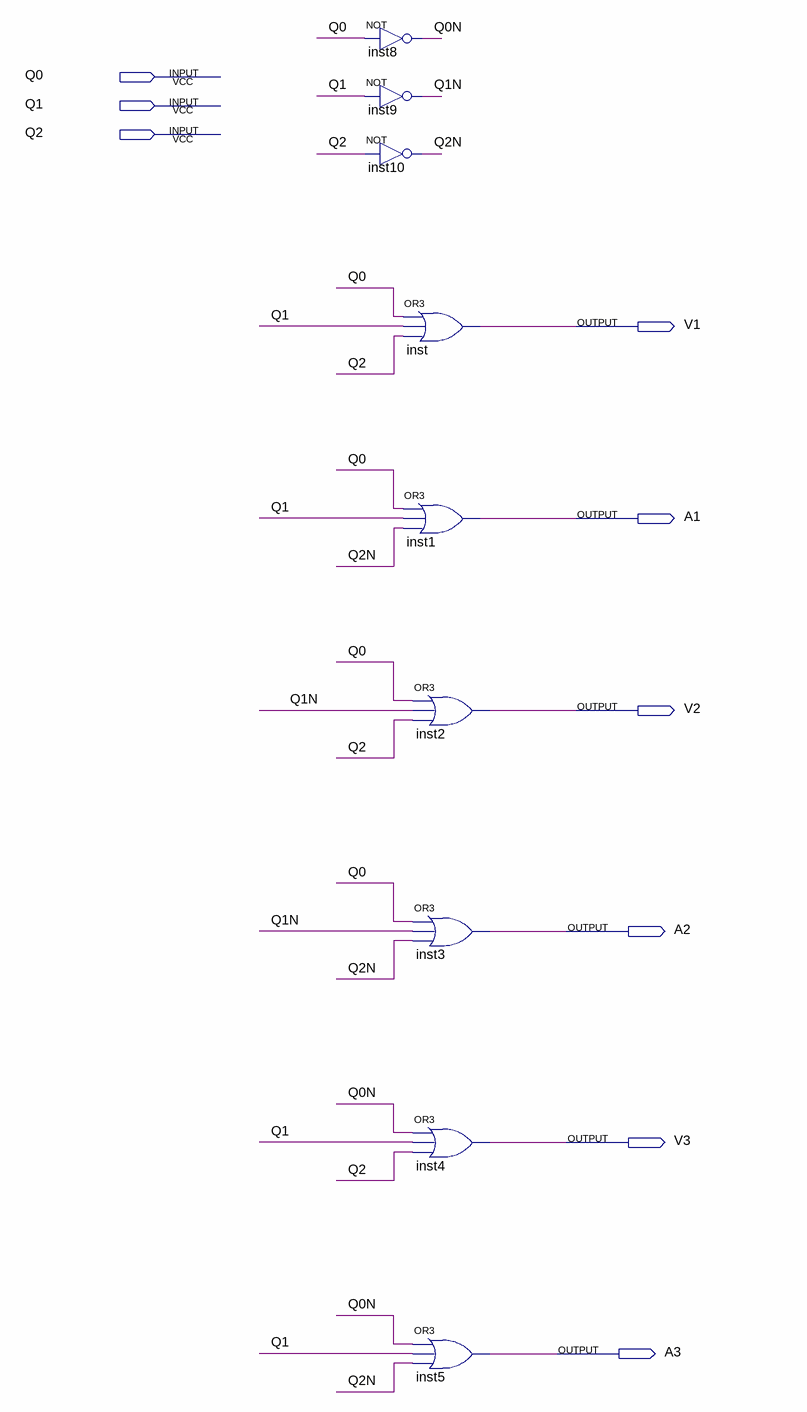
[diagram p0: schematic sheet]
// Quartus schematic Salida.bdf as structural Verilog: 9 symbols, 9 pins
module Salida (
  input  Q0,
  input  Q1,
  input  Q2,
  output V1,
  output A1,
  output V2,
  output A2,
  output V3,
  output A3
);

  wire Q0N, Q1N, Q2N;

  not inst8 (Q0N, Q0);
  not inst9 (Q1N, Q1);
  not inst10 (Q2N, Q2);
  or inst (V1, Q0, Q1, Q2);
  or inst1 (A1, Q0, Q1, Q2N);
  or inst2 (V2, Q0, Q1N, Q2);
  or inst3 (A2, Q0, Q1N, Q2N);
  or inst4 (V3, Q0N, Q1, Q2);
  or inst5 (A3, Q0N, Q1, Q2N);
endmodule
